# Altium schematic sheet Baro.SchDoc
size A4; SheetNumber: 2; SheetTotal: 13
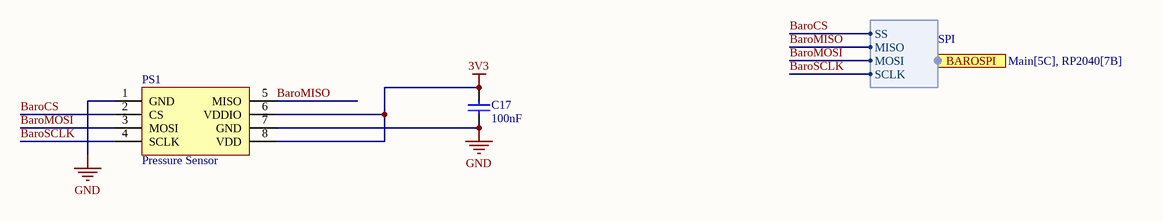
[diagram p0: Baro.SchDoc]

## Parts
C17  100nF  [0402 cap]
PS1  Pressure Sensor  [Goertek SPL06-001]

## Ports
BAROSPI (harness SPI, see Main[5C], RP2040[7B])

## Harnesses
SPI: SS, MISO, MOSI, SCLK

## Nets
3V3: C17.2 PS1.6(VDDIO) PS1.8(VDD)
GND: C17.1 PS1.1(GND) PS1.7(GND)
BaroCS: PS1.2(CS) ; port BAROSPI.SS
BaroMISO: PS1.5(MISO) ; port BAROSPI.MISO
BaroMOSI: PS1.3(MOSI) ; port BAROSPI.MOSI
BaroSCLK: PS1.4(SCLK) ; port BAROSPI.SCLK

## Library data of the parts
C17 = Capacitor 0402 100nF: Value: 100nF
PS1 = Goertek SPL06-001